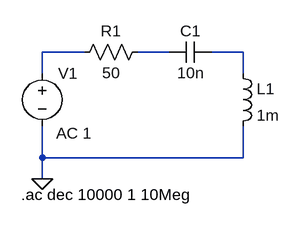
[diagram p0: schematic Circuito5.asc]
Circuito5.asc, the LTspice schematic file:
Version 4
SHEET 1 880 680
WIRE 96 96 32 96
WIRE 224 96 176 96
WIRE 336 96 288 96
WIRE 32 128 32 96
WIRE 336 128 336 96
WIRE 32 256 32 208
WIRE 336 256 336 208
WIRE 336 256 32 256
WIRE 32 288 32 256
FLAG 32 288 0
SYMBOL voltage 32 112 R0
WINDOW 123 21 107 Left 2
WINDOW 39 0 0 Left 0
SYMATTR InstName V1
SYMATTR Value ""
SYMATTR Value2 AC 1
SYMBOL res 192 80 R90
WINDOW 0 0 56 VBottom 2
WINDOW 3 32 56 VTop 2
SYMATTR InstName R1
SYMATTR Value 50
SYMBOL cap 224 112 R270
WINDOW 0 32 32 VTop 2
WINDOW 3 0 32 VBottom 2
SYMATTR InstName C1
SYMATTR Value 10n
SYMBOL ind 320 112 R0
SYMATTR InstName L1
SYMATTR Value 1m
TEXT 0 312 Left 2 !.ac dec 10000 1 10Meg

The netlist it stands for:
* Circuito5.asc
V1 N001 0 AC 1
R1 N002 N001 50
C1 N002 N003 10n
L1 N003 0 1m
.ac dec 10000 1 10Meg
.backanno
.end